# EAGLE design ARC Power v0.1 (EAGLE 6.4)
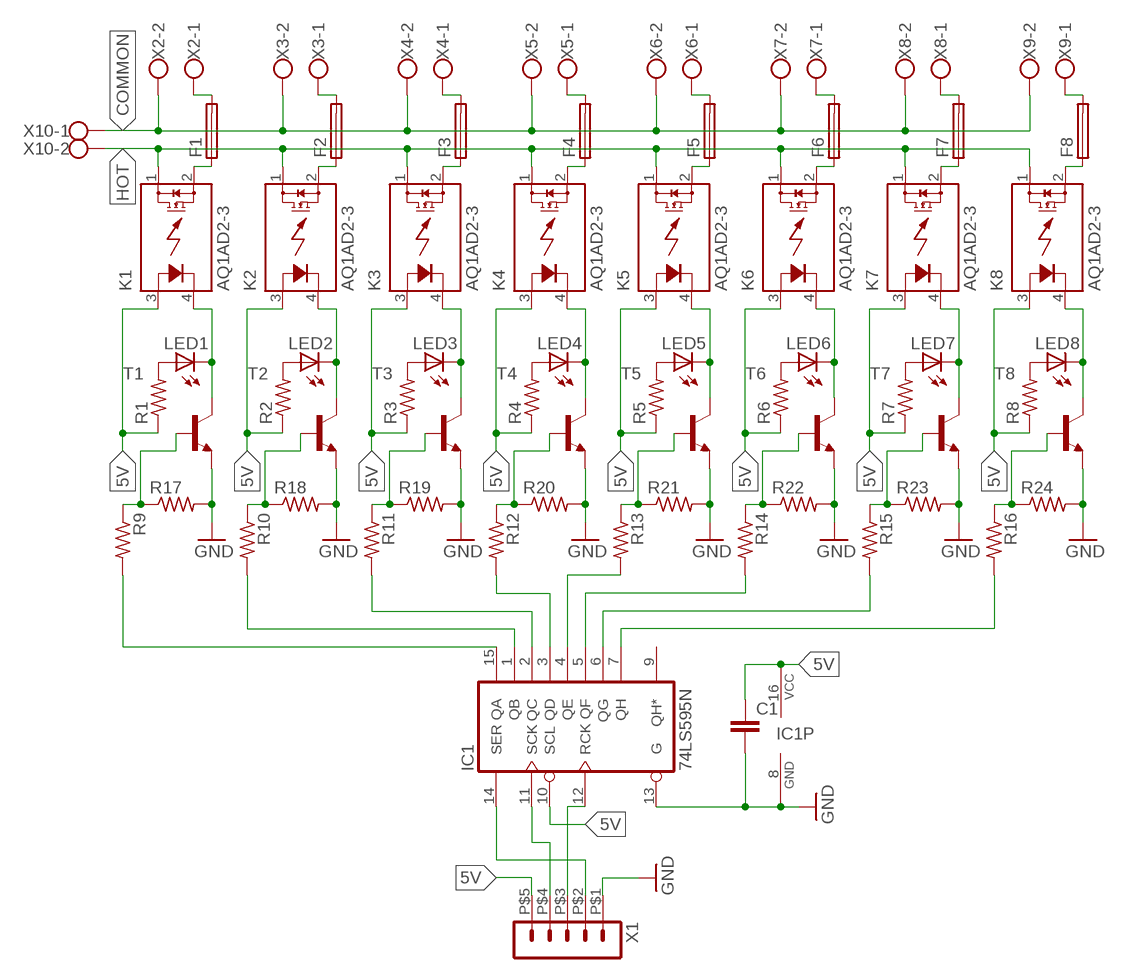
[diagram p0: schematic, sheet 1]

## Parts
C1  C5/3  [C5B3]
F1  SH22,5A  [SH22,5A]
F2  SH22,5A  [SH22,5A]
F3  SH22,5A  [SH22,5A]
F4  SH22,5A  [SH22,5A]
F5  SH22,5A  [SH22,5A]
F6  SH22,5A  [SH22,5A]
F7  SH22,5A  [SH22,5A]
F8  SH22,5A  [SH22,5A]
IC1  74LS595N  [DIL16]
K1  AQ1AD2-3  [AQ1]
K2  AQ1AD2-3  [AQ1]
K3  AQ1AD2-3  [AQ1]
K4  AQ1AD2-3  [AQ1]
K5  AQ1AD2-3  [AQ1]
K6  AQ1AD2-3  [AQ1]
K7  AQ1AD2-3  [AQ1]
K8  AQ1AD2-3  [AQ1]
LED1  LED3MM  [LED3MM]
LED2  LED3MM  [LED3MM]
LED3  LED3MM  [LED3MM]
LED4  LED3MM  [LED3MM]
LED5  LED3MM  [LED3MM]
LED6  LED3MM  [LED3MM]
LED7  LED3MM  [LED3MM]
LED8  LED3MM  [LED3MM]
R1  R-US_0204/7  [0204/7]
R2  R-US_0204/7  [0204/7]
R3  R-US_0204/7  [0204/7]
R4  R-US_0204/7  [0204/7]
R5  R-US_0204/7  [0204/7]
R6  R-US_0204/7  [0204/7]
R7  R-US_0204/7  [0204/7]
R8  R-US_0204/7  [0204/7]
R9  R-US_0204/7  [0204/7]
R10  R-US_0204/7  [0204/7]
R11  R-US_0204/7  [0204/7]
R12  R-US_0204/7  [0204/7]
R13  R-US_0204/7  [0204/7]
R14  R-US_0204/7  [0204/7]
R15  R-US_0204/7  [0204/7]
R16  R-US_0204/7  [0204/7]
R17  R-US_0204/7  [0204/7]
R18  R-US_0204/7  [0204/7]
R19  R-US_0204/7  [0204/7]
R20  R-US_0204/7  [0204/7]
R21  R-US_0204/7  [0204/7]
R22  R-US_0204/7  [0204/7]
R23  R-US_0204/7  [0204/7]
R24  R-US_0204/7  [0204/7]
T1  -NPN-TO92  [TO92]
T2  -NPN-TO92  [TO92]
T3  -NPN-TO92  [TO92]
T4  -NPN-TO92  [TO92]
T5  -NPN-TO92  [TO92]
T6  -NPN-TO92  [TO92]
T7  -NPN-TO92  [TO92]
T8  -NPN-TO92  [TO92]
X1  HEADER_POS5_43650-0500  [43650-0500]
X2  W237-113  [W237-113]
X3  W237-113  [W237-113]
X4  W237-113  [W237-113]
X5  W237-113  [W237-113]
X6  W237-113  [W237-113]
X7  W237-113  [W237-113]
X8  W237-113  [W237-113]
X9  W237-113  [W237-113]
X10  W237-102  [W237-102]

## Nets
5V [1A]: C1.1 IC1.10(SCL) IC1.16(VCC) K1.3(A) K2.3(A) K3.3(A) K4.3(A) K5.3(A) K6.3(A) K7.3(A) K8.3(A) R1.1 R2.1 R3.1 R4.1 R5.1 R6.1 R7.1 R8.1 X1.P$5
COMMON [5A]: X2.2 X3.2 X4.2 X5.2 X6.2 X7.2 X8.2 X9.2 X10.1
GND [1A]: C1.2 IC1.8(GND) IC1.13(G) R17.2 R18.2 R19.2 R20.2 R21.2 R22.2 R23.2 R24.2 T1.1(E) T2.1(E) T3.1(E) T4.1(E) T5.1(E) T6.1(E) T7.1(E) T8.1(E) X1.P$1
HOT [5A]: K1.1(DS1) K2.1(DS1) K3.1(DS1) K4.1(DS1) K5.1(DS1) K6.1(DS1) K7.1(DS1) K8.1(DS1) X10.2
N$1: IC1.15(QA) R9.2
N$2: IC1.1(QB) R10.2
N$3: IC1.2(QC) R11.2
N$4: IC1.3(QD) R12.2
N$5: IC1.4(QE) R13.2
N$6: IC1.5(QF) R14.2
N$7: IC1.6(QG) R15.2
N$8: IC1.7(QH) R16.2
N$9 [5A]: F1.1 K1.2(DS2)
N$10 [5A]: F1.2 X2.1
N$11 [5A]: F2.1 K2.2(DS2)
N$12 [5A]: F2.2 X3.1
N$13 [5A]: F3.1 K3.2(DS2)
N$14 [5A]: F3.2 X4.1
N$15 [5A]: F4.1 K4.2(DS2)
N$16 [5A]: F4.2 X5.1
N$17 [5A]: F5.1 K5.2(DS2)
N$18: IC1.14(SER) X1.P$2
N$19: IC1.12(RCK) X1.P$3
N$20: IC1.11(SCK) X1.P$4
N$21 [5A]: F5.2 X6.1
N$22 [5A]: F6.1 K6.2(DS2)
N$23 [5A]: F6.2 X7.1
N$24 [5A]: F7.1 K7.2(DS2)
N$25 [5A]: F7.2 X8.1
N$26 [5A]: F8.1 K8.2(DS2)
N$27 [5A]: F8.2 X9.1
N$28: LED1.A R1.2
N$29: LED2.A R2.2
N$30: LED3.A R3.2
N$31: LED4.A R4.2
N$32: LED5.A R5.2
N$33: LED6.A R6.2
N$34: LED7.A R7.2
N$35: LED8.A R8.2
N$36: K1.4(K) LED1.K(C) T1.3(C)
N$37: K2.4(K) LED2.K(C) T2.3(C)
N$38: K3.4(K) LED3.K(C) T3.3(C)
N$39: K4.4(K) LED4.K(C) T4.3(C)
N$40: K5.4(K) LED5.K(C) T5.3(C)
N$41: K6.4(K) LED6.K(C) T6.3(C)
N$42: K7.4(K) LED7.K(C) T7.3(C)
N$43: K8.4(K) LED8.K(C) T8.3(C)
N$44: R9.1 R17.1 T1.2(B)
N$45: R10.1 R18.1 T2.2(B)
N$46: R11.1 R19.1 T3.2(B)
N$47: R12.1 R20.1 T4.2(B)
N$48: R13.1 R21.1 T5.2(B)
N$49: R14.1 R22.1 T6.2(B)
N$50: R15.1 R23.1 T7.2(B)
N$51: R16.1 R24.1 T8.2(B)
Unconnected: IC1.9(QH*)

## Library data of the parts
C1 = capacitor-wima:C: CAPACITOR naming: grid - package width
F1-F8 = fuse:SH22,5A: FUSE HOLDER grid 22,5mm, isolated cap OGN0031 8201, Schurter (Buerklin); MPN: 0031.7701.11; OC_FARNELL: unknown; OC_NEWARK: 04F1224
IC1 = 74xx-us:74*595: 8-bit SHIFT REGISTER, output latch
K1-K8 = relay:AQ*: SOLID STATE RELAY NAiS Source: http://www.mew-europe.com/.. en_ds_61601_0000.pdf; MF: AROMAT/ MATSUSHITA; MPN: AQ1AD2-3/28VDC; OC_FARNELL: unknown; OC_NEWARK: 10C4052
LED1-LED8 = led:LED: LED OSRAM: - CHIPLED LG R971, LG N971, LY N971, LG Q971, LY Q971, LO R971, LY R971 LH N974, LH R974 LS Q976, LO Q976, LY Q976 LO Q996 - Hyper CHIPLED LW Q18S LB Q993, LB Q99A, LB R99A - SideLED LS A670, LO A670, LY A670, LG A670, LP A670 LB A673, LV A673, LT A673, LW A673 LH A674 LY A675 LS A676, LA A676, LO A676, LY A676, LW A676 LS A679, LY A679, LG A679 - Hyper Micro SIDELED® LS Y876, LA Y876, LO Y876, LY Y876 LT Y87S - SmartLED LW L88C, LW L88S LB L89C, LB L89S, LG L890 LS L89K, LO L89K, LY L89K LS L896, LA L896, LO L896, LY L896 - TOPLED LS T670, LO T670, LY T670, LG T670, LP T670 LSG T670, LSP T670, LSY T670, LOP T670, LYG T670 LG T671, LOG T671, LSG T671 LB T673, LV T673, LT T673, LW T673 LH T674 LS T676, LA T676, LO T676, LY T676, LB T676, LH T676, LSB T676, LW T676 LB T67C, LV T67C, LT T67C, LS T67K, LO T67K, LY T67K, LW E67C LS E67B, LA E67B, LO E67B, LY E67B, LB E67C, LV E67C, LT E67C LW T67C LS T679, LY T679, LG T679 LS T770, LO T770, LY T770, LG T770, LP T770 LB T773, LV T773, LT T773, LW T773 LH T774 LS E675, LA E675, LY E675, LS T675 LS T776, LA T776, LO T776, LY T776, LB T776 LHGB T686 LT T68C, LB T68C - Hyper Mini TOPLED® LB M676 - Mini TOPLED Santana® LG M470 LS M47K, LO M47K, LY M47K Source: http://www.osram.convergy.de LUXEON: - LUMILED® LXK2-PW12-R00, LXK2-PW12-S00, LXK2-PW14-U00, LXK2-PW14-V00 LXK2-PM12-R00, LXK2-PM12-S00, LXK2-PM14-U00 LXK2-PE12-Q00, LXK2-PE12-R00, LXK2-PE12-S00, LXK2-PE14-T00, LXK2-PE14-U00 LXK2-PB12-K00, LXK2-PB12-L00, LXK2-PB12-M00, LXK2-PB14-N00, LXK2-PB14-P00, LXK2-PB14-Q00 LXK2-PR12-L00, LXK2-PR12-M00, LXK2-PR14-Q00, LXK2-PR14-R00 LXK2-PD12-Q00, LXK2-PD12-R00, LXK2-PD12-S00 LXK2-PH12-R00, LXK2-PH12-S00 LXK2-PL12-P00, LXK2-PL12-Q00, LXK2-PL12-R00 Source: www.luxeon.com KINGBRIGHT: KA-3528ASYC Source: www.kingbright.com
R1-R24 = resistor:R-US_: RESISTOR, American symbol
T1-T8 = transistor:*-NPN-: NPN Transistror BF959 corrected 2008.03.06
X1 = con-molex-micro-fit-3_0:HEADER_POS5_?: Molex - Micro-Fit 3.0 Series connector, 3.00mm (0.118") pitch header, 5 positions.
X2-X9 = con-wago-500:W237-113: WAGO SCREW CLAMP; OC_FARNELL: unknown; OC_NEWARK: unknown
X10 = con-wago-500:W237-102: WAGO SCREW CLAMP; MPN: 237-102; OC_FARNELL: unknown; OC_NEWARK: 70K9898

## Net classes
0 default: width 0.305 mm, drill 0.305 mm, clearance 0.356 mm
1 1A: width 0.762 mm, drill 0.762 mm, clearance 0.356 mm
2 5A: width 7.366 mm, drill 7.366 mm, clearance 1.016 mm

## Board
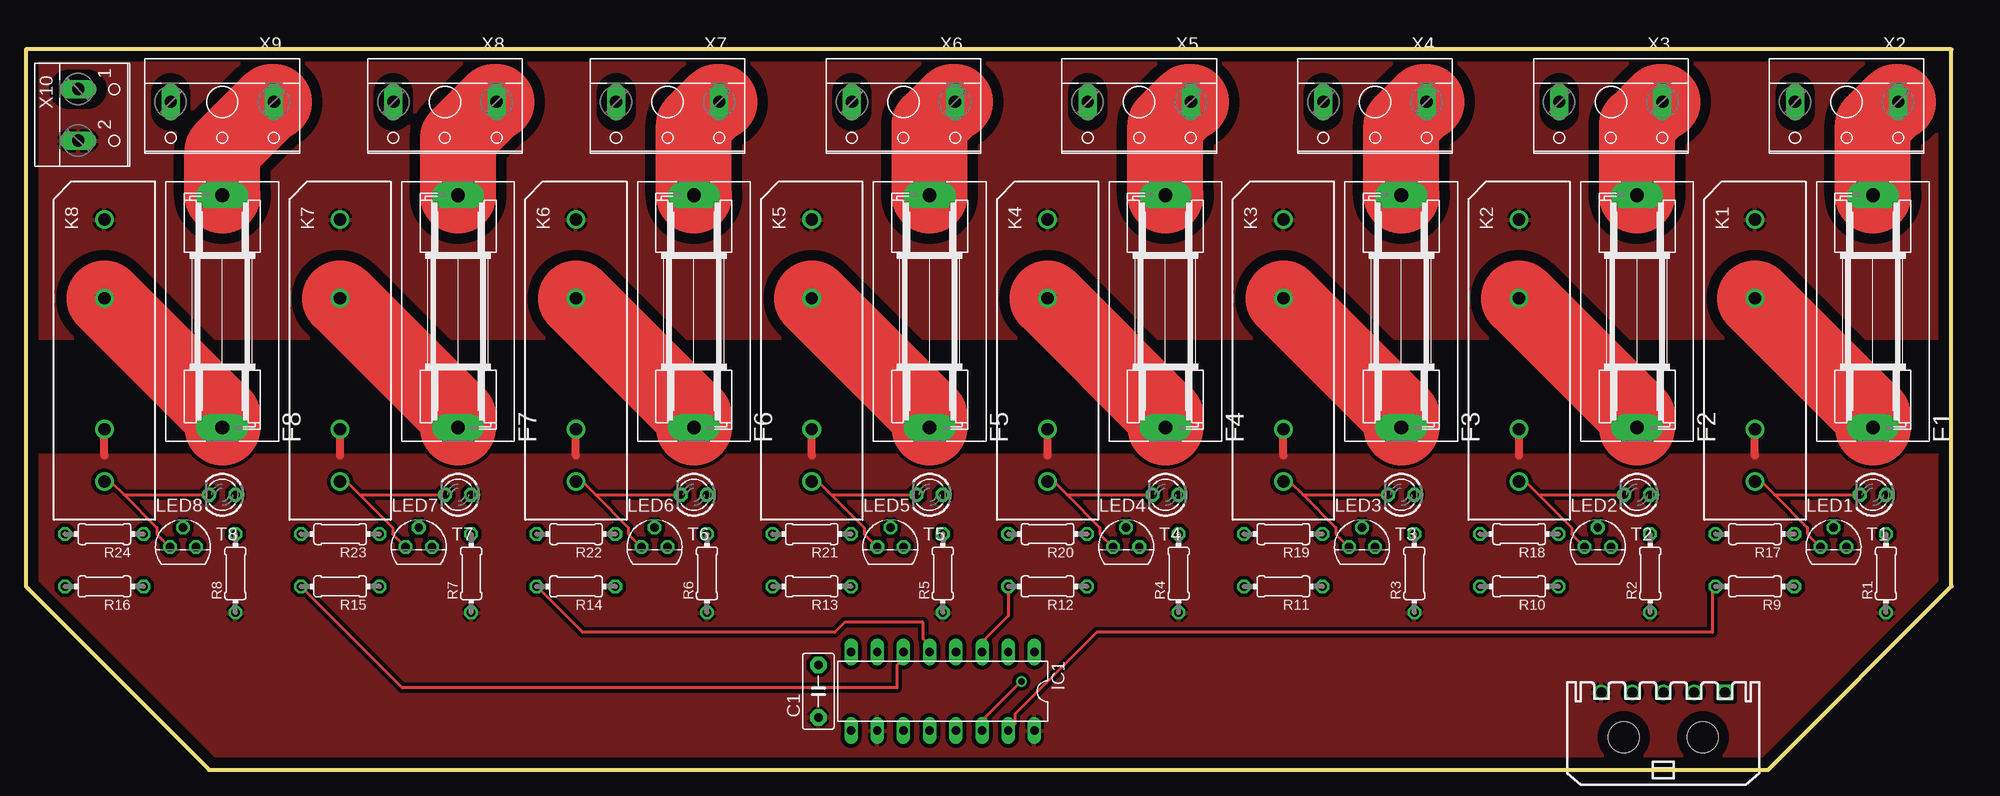
[diagram p1: board, top side]
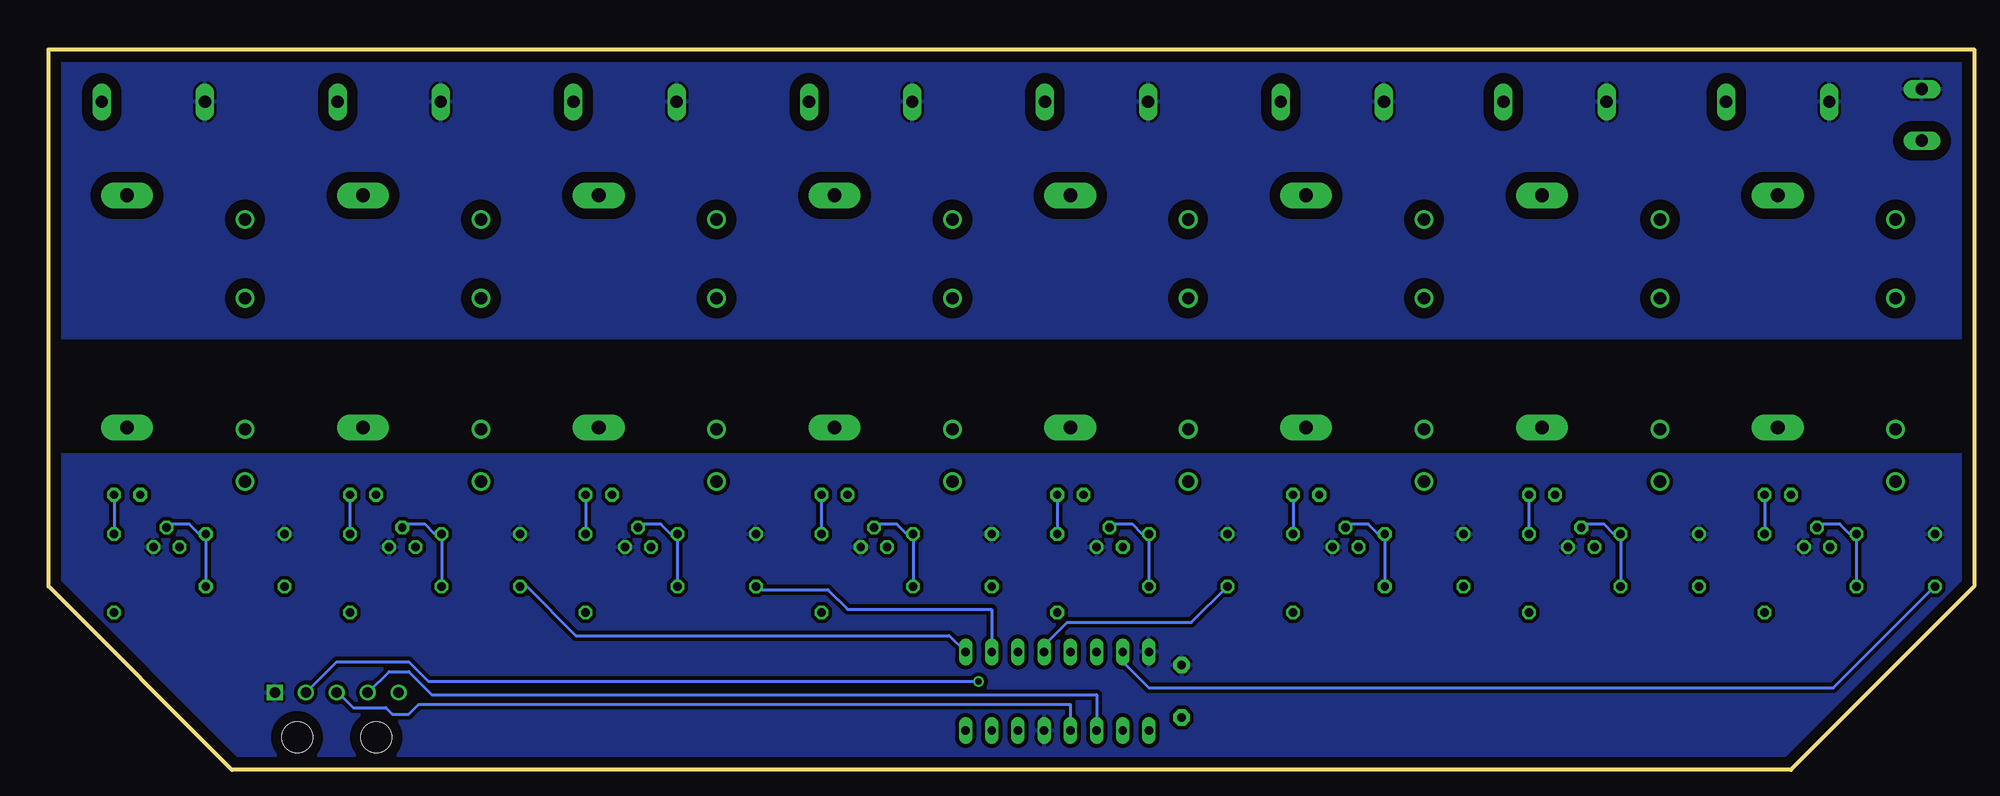
[diagram p2: board, bottom side, seen from below]

Size 186.69 x 69.85 mm. Coordinates in mm from the lower left corner, seen from the top.
Outline: 186.69,17.78 186.69,69.85 0,69.85 0,17.78 17.78,0 168.91,0 186.69,17.78
Copper layers (1*16): Top 0.035mm / dielectric 1.5mm / Bottom 0.035mm
Design rules "default": minimum track width 10mil, minimum drill 24mil, track to track 8mil, track to pad 8mil, pad to pad 8mil, via to via 8mil, smd to smd 8mil, copper to edge 40mil, drill to drill 8mil, minimum pad ring 10mil, minimum via ring 8mil, stop-mask expansion 4mil, vias tented up to drill 0mil, thermal gap 10mil

### Footprints (pad centres in the part's own frame; a part is rotated, then mirrored left to right if it is on the bottom)
C5B3 = drill 0.813 pad 1.6 octagon: 1 -2.54,0; 2 2.54,0
SH22,5A = drill 1.321 pad 2.54 long: 1 -11.252,0; 2 11.252,0
DIL16 = drill 0.813 long: 1 -8.89,-3.81; 2 -6.35,-3.81; 3 -3.81,-3.81; 4 -1.27,-3.81; 5 1.27,-3.81; 6 3.81,-3.81; 7 6.35,-3.81; 8 8.89,-3.81; 9 8.89,3.81; 10 6.35,3.81; 11 3.81,3.81; 12 1.27,3.81; 13 -1.27,3.81; 14 -3.81,3.81; 15 -6.35,3.81; 16 -8.89,3.81
AQ1 = drill 1.2: 1 -12.7,0; 2 -5.08,0; 3 7.62,0; 4 12.7,0
LED3MM = drill 0.813 octagon: A -1.27,0; K 1.27,0
0204/7 = drill 0.813 octagon: 1 -3.81,0; 2 3.81,0
TO92 = drill 0.813 octagon: 1 1.27,0; 2 0,1.905; 3 -1.27,0
43650-0500 = drill 1.02 square: P$1 6,4.32 | drill 1.02: P$2 3,4.32; P$3 0,4.32; P$4 -3,4.32; P$5 -6,4.32 | hole 3: 3.85,0; -3.85,0
W237-113 = drill 1.194 long: 1 -5,-1.27; 2 5,-1.27
W237-102 = drill 1.194 long: 1 -2.5,-1.27; 2 2.5,-1.27

### Placement (x,y rotation side)
C1  76.83,7.62 90 top
F1  179.07,44.45 90 top
F2  156.21,44.45 90 top
F3  133.35,44.45 90 top
F4  110.49,44.45 90 top
F5  87.63,44.45 90 top
F6  64.77,44.45 90 top
F7  41.91,44.45 90 top
F8  19.05,44.45 90 top
IC1  88.9,7.62 180 top
K1  167.64,40.64 270 top
K2  144.78,40.64 270 top
K3  121.92,40.64 270 top
K4  99.06,40.64 270 top
K5  76.2,40.64 270 top
K6  53.34,40.64 270 top
K7  30.48,40.64 270 top
K8  7.62,40.64 270 top
LED1  179.07,26.67 180 top
LED2  156.21,26.67 180 top
LED3  133.35,26.67 180 top
LED4  110.49,26.67 180 top
LED5  87.63,26.67 180 top
LED6  64.77,26.67 180 top
LED7  41.91,26.67 180 top
LED8  19.05,26.67 180 top
R1  180.34,19.05 90 top
R2  157.48,19.05 90 top
R3  134.62,19.05 90 top
R4  111.76,19.05 90 top
R5  88.9,19.05 90 top
R6  66.04,19.05 90 top
R7  43.18,19.05 90 top
R8  20.32,19.05 90 top
R9  167.64,17.78 180 top
R10  144.78,17.78 180 top
R11  121.92,17.78 180 top
R12  99.06,17.78 180 top
R13  76.2,17.78 180 top
R14  53.34,17.78 180 top
R15  30.48,17.78 180 top
R16  7.62,17.78 180 top
R17  167.64,22.86 180 top
R18  144.78,22.86 180 top
R19  121.92,22.86 180 top
R20  99.06,22.86 180 top
R21  76.2,22.86 180 top
R22  53.34,22.86 180 top
R23  30.48,22.86 180 top
R24  7.62,22.86 180 top
T1  175.26,21.59 0 top
T2  152.4,21.59 0 top
T3  129.54,21.59 0 top
T4  106.68,21.59 0 top
T5  83.82,21.59 0 top
T6  60.96,21.59 0 top
T7  38.1,21.59 0 top
T8  15.24,21.59 0 top
X1  158.75,3.17 0 top
X2  176.53,63.5 180 top
X3  153.67,63.5 180 top
X4  130.81,63.5 180 top
X5  107.95,63.5 180 top
X6  85.09,63.5 180 top
X7  62.23,63.5 180 top
X8  40.64,63.5 180 top
X9  19.05,63.5 180 top
X10  6.35,63.5 270 top

### Tracks (layer width: path | path; a pad name or v marks a point on that pad's centre or on a via)
5V
  Top 0.762: 7.62,30.48 K8.3 | 30.48,30.48 K7.3 | 53.34,30.48 K6.3 | 76.2,30.48 K5.3 | 99.06,30.48 K4.3 | 121.92,30.48 K3.3 | 144.78,30.48 K2.3 | 167.64,30.48 K1.3
  pour Top: 186.69,30.48 186.69,17.78 168.91,0 17.78,0 0,17.78 0,30.48
COMMON
  pour Bottom: 0,69.85 0,41.91 186.69,41.91 186.69,69.85
GND
  pour Bottom: 186.69,30.48 186.69,17.78 168.91,0 17.78,0 0,17.78 0,30.48
HOT
  pour Top: 0,69.85 0,41.91 186.69,41.91 186.69,69.85
N$1
  Top 0.305: IC1.15 95.88,4.45 95.88,5.4 103.82,13.34 163.51,13.34 163.51,17.46 R9.2
N$2
  Bottom 0.305: IC1.1 99.38,13.02 135.57,13.02 140.34,17.78 R10.2
N$3
  Bottom 0.305: IC1.2 95.25,15.56 109.22,15.56 111.12,17.46 117.79,17.46 R11.2
N$4
  Top 0.305: IC1.3 93.03,11.75 93.03,12.7 95.25,14.92 R12.2
N$5
  Bottom 0.305: R13.2 75.88,14.29 87.95,14.29 90.17,12.07 IC1.4
N$6
  Top 0.305: R14.2 53.98,13.34 78.42,13.34 79.38,14.29 86.99,14.29 86.99,12.7 87.63,12.07 IC1.5
N$7
  Top 0.305: R15.2 36.51,7.94 84.45,7.94 84.45,10.16 85.09,10.8 IC1.6
N$8
  Bottom 0.305: R16.2 13.65,7.94 80.01,7.94 82.55,10.48 IC1.7
N$9
  Top 7.366: K1.2 179.07,34.29 F1.1
N$10
  Top 7.366: F1.2 179.07,62.55 181.29,64.77 X2.1
N$11
  Top 7.366: K2.2 156.21,34.29 F2.1
N$12
  Top 7.366: F2.2 156.21,62.55 158.43,64.77 X3.1
N$13
  Top 7.366: K3.2 133.35,34.29 F3.1
N$14
  Top 7.366: F3.2 133.35,62.55 135.57,64.77 X4.1
N$15
  Top 7.366: K4.2 110.49,34.29 F4.1
N$16
  Top 7.366: F4.2 110.49,62.55 112.71,64.77 X5.1
N$17
  Top 7.366: K5.2 87.63,34.29 F5.1
N$18  (via drill 0.61)
  Top 0.305: IC1.14 93.03,4.13 93.03,5.08 v96.52,8.57
  Bottom 0.305: v96.52,8.57 149.86,8.57 151.77,10.48 158.75,10.48 161.61,7.62 X1.P$2
N$19
  Bottom 0.305: IC1.12 87.63,6.35 150.81,6.35 151.77,5.4 153.35,5.4 153.99,6.03 157.16,6.03 158.43,7.3 158.75,7.3 X1.P$3
N$20
  Bottom 0.305: IC1.11 85.09,7.3 149.54,7.3 151.77,9.53 153.67,9.53 155.58,7.62 X1.P$4
N$21
  Top 7.366: F5.2 87.63,62.55 89.85,64.77 X6.1
N$22
  Top 7.366: K6.2 64.77,34.29 F6.1
N$23
  Top 7.366: F6.2 64.77,62.55 66.99,64.77 X7.1
N$24
  Top 7.366: K7.2 41.91,34.29 F7.1
N$25
  Top 7.366: F7.2 41.91,61.28 45.4,64.77 X8.1
N$26
  Top 7.366: K8.2 19.05,34.29 F8.1
N$27
  Top 7.366: F8.2 19.05,60.01 23.81,64.77 X9.1
N$28
  Bottom 0.305: LED1.A R1.2
N$29
  Bottom 0.305: LED2.A R2.2
N$30
  Bottom 0.305: LED3.A R3.2
N$31
  Bottom 0.305: LED4.A R4.2
N$32
  Bottom 0.305: LED5.A R5.2
N$33
  Bottom 0.305: LED6.A R6.2
N$34
  Bottom 0.305: LED7.A R7.2
N$35
  Bottom 0.305: LED8.A R8.2
N$36
  Top 0.305: T1.3 172.72,22.86 172.72,23.49 169.55,26.67 | 169.55,26.67 168.28,27.94 K1.4 | 169.55,26.67 LED1.K
N$37
  Top 0.305: T2.3 149.86,22.86 149.86,23.49 146.69,26.67 | 146.69,26.67 145.42,27.94 K2.4 | 146.69,26.67 LED2.K
N$38
  Top 0.305: T3.3 127,22.86 127,23.49 123.83,26.67 | 123.83,26.67 122.55,27.94 K3.4 | 123.83,26.67 LED3.K
N$39
  Top 0.305: T4.3 104.14,22.86 104.14,23.49 100.96,26.67 | 100.96,26.67 99.69,27.94 K4.4 | 100.96,26.67 LED4.K
N$40
  Top 0.305: T5.3 81.28,22.86 81.28,23.49 78.1,26.67 | 78.1,26.67 76.83,27.94 K5.4 | 78.1,26.67 LED5.K
N$41
  Top 0.305: T6.3 58.42,22.86 58.42,23.49 55.25,26.67 | 55.25,26.67 53.98,27.94 K6.4 | 55.25,26.67 LED6.K
N$42
  Top 0.305: T7.3 35.56,22.86 35.56,23.49 32.38,26.67 | 32.38,26.67 31.11,27.94 K7.4 | 32.38,26.67 LED7.K
N$43
  Top 0.305: T8.3 12.7,22.86 12.7,23.49 9.53,26.67 | 9.53,26.67 8.26,27.94 K8.4 | 9.53,26.67 LED8.K
N$44
  Bottom 0.305: R9.1 R17.1 172.09,22.86 173.04,23.81 174.94,23.81 T1.2
N$45
  Bottom 0.305: R10.1 R18.1 149.23,22.86 150.18,23.81 152.08,23.81 T2.2
N$46
  Bottom 0.305: R11.1 R19.1 126.36,22.86 127.32,23.81 129.22,23.81 T3.2
N$47
  Bottom 0.305: R12.1 R20.1 103.5,22.86 104.46,23.81 106.36,23.81 T4.2
N$48
  Bottom 0.305: R13.1 R21.1 80.64,22.86 81.6,23.81 83.5,23.81 T5.2
N$49
  Bottom 0.305: R14.1 R22.1 57.79,22.86 58.74,23.81 60.64,23.81 T6.2
N$50
  Bottom 0.305: R15.1 R23.1 34.93,22.86 35.88,23.81 37.78,23.81 T7.2
N$51
  Bottom 0.305: R16.1 R24.1 12.06,22.86 13.02,23.81 14.92,23.81 T8.2